# EAGLE board EuroCard Backplane (EAGLE 6.5.0)
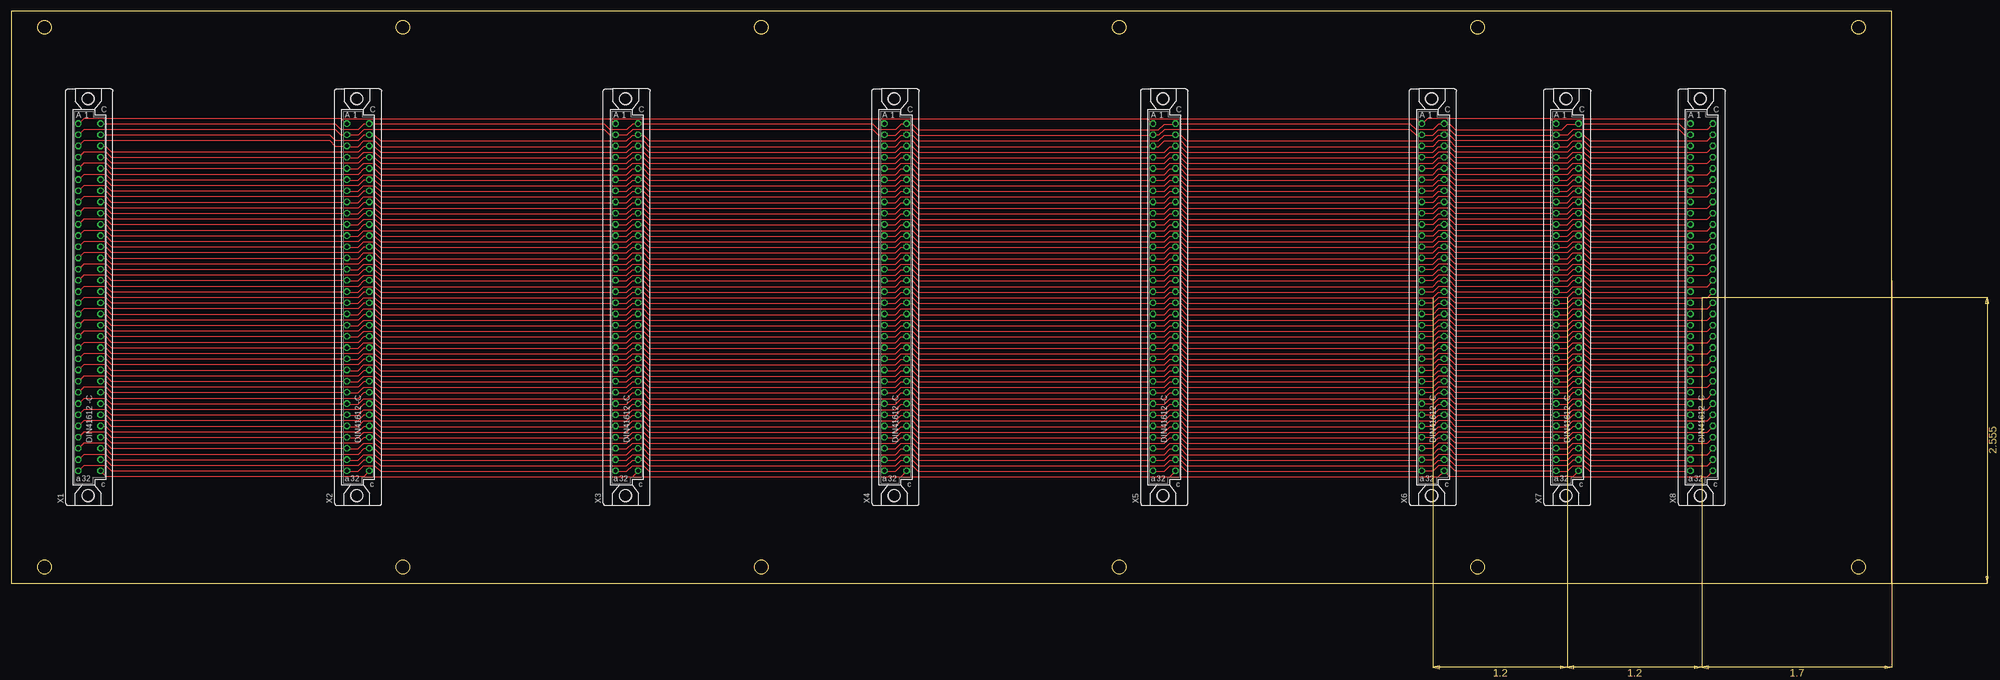
[diagram p1: board, top side]

Size 426.72 x 129.79 mm. Coordinates in mm from the lower left corner, seen from the top.
Copper layers (1+2*15+16): Top 0.035mm / dielectric 1.5mm / Route2 0.035mm / dielectric 0.15mm / Route15 0.035mm / dielectric 0.2mm / Bottom 0.035mm
Design rules "default *": minimum track width 10mil, minimum drill 24mil, track to track 8mil, track to pad 8mil, pad to pad 8mil, via to via 8mil, smd to smd 8mil, copper to edge 40mil, drill to drill 8mil, minimum pad ring 10mil, minimum via ring 8mil, stop-mask expansion 4mil, vias tented up to drill 0mil, thermal gap 10mil

## Footprints (pad centres in the part's own frame; a part is rotated, then mirrored left to right if it is on the bottom)
FAC64S = drill 0.914 octagon: A1 -2.54,39.37; A2 -2.54,36.83; A3 -2.54,34.29; A4 -2.54,31.75; A5 -2.54,29.21; A6 -2.54,26.67; A7 -2.54,24.13; A8 -2.54,21.59; A9 -2.54,19.05; A10 -2.54,16.51; A11 -2.54,13.97; A12 -2.54,11.43; A13 -2.54,8.89; A14 -2.54,6.35; A15 -2.54,3.81; A16 -2.54,1.27; A17 -2.54,-1.27; A18 -2.54,-3.81; A19 -2.54,-6.35; A20 -2.54,-8.89; A21 -2.54,-11.43; A22 -2.54,-13.97; A23 -2.54,-16.51; A24 -2.54,-19.05; A25 -2.54,-21.59; A26 -2.54,-24.13; A27 -2.54,-26.67; A28 -2.54,-29.21; A29 -2.54,-31.75; A30 -2.54,-34.29; A31 -2.54,-36.83; A32 -2.54,-39.37; C1 2.54,39.37; C2 2.54,36.83; C3 2.54,34.29; C4 2.54,31.75; C5 2.54,29.21; C6 2.54,26.67; C7 2.54,24.13; C8 2.54,21.59; C9 2.54,19.05; C10 2.54,16.51; C11 2.54,13.97; C12 2.54,11.43; C13 2.54,8.89; C14 2.54,6.35; C15 2.54,3.81; C16 2.54,1.27; C17 2.54,-1.27; C18 2.54,-3.81; C19 2.54,-6.35; C20 2.54,-8.89; C21 2.54,-11.43; C22 2.54,-13.97; C23 2.54,-16.51; C24 2.54,-19.05; C25 2.54,-21.59; C26 2.54,-24.13; C27 2.54,-26.67; C28 2.54,-29.21; C29 2.54,-31.75; C30 2.54,-34.29; C31 2.54,-36.83; C32 2.54,-39.37 | hole 2.794: -0.305,45.009; -0.305,-45.009

## Placement (x,y rotation side)
U$1  BACKPLANE  [BACKPLANE]  0,0 0 top
X1  FAC64S  [FAC64S]  17.78,64.9 0 top
X2  FAC64S  [FAC64S]  78.74,64.9 0 top
X3  FAC64S  [FAC64S]  139.7,64.9 0 top
X4  FAC64S  [FAC64S]  200.66,64.9 0 top
X5  FAC64S  [FAC64S]  261.62,64.9 0 top
X6  FAC64S  [FAC64S]  322.58,64.9 0 top
X7  FAC64S  [FAC64S]  353.06,64.9 0 top
X8  FAC64S  [FAC64S]  383.54,64.9 0 top

## Tracks (layer width: path | path; a pad name or v marks a point on that pad's centre or on a via)
A1
  Top 0.254: 320.04,104.14 321.31,105.41 349.25,105.41 | 349.25,105.41 350.52,104.14 X7.A1 | 349.25,105.41 379.73,105.41 381,104.14 X8.A1 | 74.93,105.41 16.51,105.41 15.24,104.14 X1.A1 | 74.93,105.41 76.2,104.14 X2.A1 | 135.89,105.41 137.16,104.14 X3.A1 | 74.93,105.41 135.89,105.41 | 196.85,105.41 198.12,104.14 X4.A1 | 135.89,105.41 196.85,105.41 | 257.81,105.41 259.08,104.14 X5.A1 | 196.85,105.41 257.81,105.41 | 320.04,104.14 318.77,105.41 257.81,105.41 | 320.04,104.14 X6.A1
A2
  Top 0.254: 350.52,101.6 353.06,101.6 354.33,102.87 378.46,102.87 379.73,101.6 381,101.6 X8.A2 | 259.08,101.6 260.35,101.6 261.62,102.87 317.5,102.87 318.77,101.6 320.04,101.6 | 350.52,101.6 327.66,101.6 326.39,102.87 323.85,102.87 322.58,101.6 320.04,101.6 | 350.52,101.6 X7.A2 | 320.04,101.6 X6.A2 | 76.2,101.6 74.93,101.6 73.66,102.87 16.51,102.87 15.24,101.6 X1.A2 | 137.16,101.6 139.7,101.6 140.97,102.87 195.58,102.87 196.85,101.6 198.12,101.6 | 76.2,101.6 78.74,101.6 80.01,102.87 134.62,102.87 135.89,101.6 137.16,101.6 | 76.2,101.6 X2.A2 | 137.16,101.6 X3.A2 | 259.08,101.6 205.74,101.6 204.47,102.87 201.93,102.87 200.66,101.6 198.12,101.6 | 259.08,101.6 X5.A2 | 198.12,101.6 X4.A2
A3
  Top 0.254: 320.04,99.06 322.58,99.06 323.85,100.33 326.39,100.33 327.66,99.06 350.52,99.06 | 350.52,99.06 353.06,99.06 354.33,100.33 356.87,100.33 358.14,99.06 381,99.06 X8.A3 | 350.52,99.06 X7.A3 | 76.2,99.06 73.66,99.06 72.39,100.33 16.51,100.33 15.24,99.06 X1.A3 | 137.16,99.06 83.82,99.06 82.55,100.33 80.01,100.33 78.74,99.06 76.2,99.06 | 76.2,99.06 X2.A3 | 198.12,99.06 144.78,99.06 143.51,100.33 140.97,100.33 139.7,99.06 137.16,99.06 | 137.16,99.06 X3.A3 | 259.08,99.06 205.74,99.06 204.47,100.33 201.93,100.33 200.66,99.06 198.12,99.06 | 198.12,99.06 X4.A3 | 320.04,99.06 266.7,99.06 265.43,100.33 261.62,100.33 260.35,99.06 259.08,99.06 | 320.04,99.06 X6.A3 | 259.08,99.06 X5.A3
A4
  Top 0.254: 320.04,96.52 322.58,96.52 323.85,97.79 326.39,97.79 327.66,96.52 350.52,96.52 | 350.52,96.52 353.06,96.52 354.33,97.79 356.87,97.79 358.14,96.52 381,96.52 X8.A4 | 350.52,96.52 X7.A4 | 76.2,96.52 22.86,96.52 21.59,97.79 16.51,97.79 15.24,96.52 X1.A4 | 137.16,96.52 83.82,96.52 82.55,97.79 80.01,97.79 78.74,96.52 76.2,96.52 | 76.2,96.52 X2.A4 | 198.12,96.52 144.78,96.52 143.51,97.79 140.97,97.79 139.7,96.52 137.16,96.52 | 137.16,96.52 X3.A4 | 259.08,96.52 205.74,96.52 204.47,97.79 201.93,97.79 200.66,96.52 198.12,96.52 | 198.12,96.52 X4.A4 | 320.04,96.52 266.7,96.52 265.43,97.79 262.89,97.79 261.62,96.52 259.08,96.52 | 320.04,96.52 X6.A4 | 259.08,96.52 X5.A4
A5
  Top 0.254: 320.04,93.98 322.58,93.98 323.85,95.25 326.39,95.25 327.66,93.98 350.52,93.98 | 350.52,93.98 353.06,93.98 354.33,95.25 356.87,95.25 358.14,93.98 381,93.98 X8.A5 | 350.52,93.98 X7.A5 | 76.2,93.98 22.86,93.98 21.59,95.25 16.51,95.25 15.24,93.98 X1.A5 | 137.16,93.98 83.82,93.98 82.55,95.25 80.01,95.25 78.74,93.98 76.2,93.98 | 76.2,93.98 X2.A5 | 198.12,93.98 144.78,93.98 143.51,95.25 140.97,95.25 139.7,93.98 137.16,93.98 | 137.16,93.98 X3.A5 | 259.08,93.98 205.74,93.98 204.47,95.25 201.93,95.25 200.66,93.98 198.12,93.98 | 198.12,93.98 X4.A5 | 320.04,93.98 266.7,93.98 265.43,95.25 262.89,95.25 261.62,93.98 259.08,93.98 | 320.04,93.98 X6.A5 | 259.08,93.98 X5.A5
A6
  Top 0.254: 320.04,91.44 322.58,91.44 323.85,92.71 326.39,92.71 327.66,91.44 350.52,91.44 | 350.52,91.44 353.06,91.44 354.33,92.71 356.87,92.71 358.14,91.44 381,91.44 X8.A6 | 350.52,91.44 X7.A6 | 76.2,91.44 22.86,91.44 21.59,92.71 16.51,92.71 15.24,91.44 X1.A6 | 137.16,91.44 83.82,91.44 82.55,92.71 80.01,92.71 78.74,91.44 76.2,91.44 | 76.2,91.44 X2.A6 | 198.12,91.44 144.78,91.44 143.51,92.71 140.97,92.71 139.7,91.44 137.16,91.44 | 137.16,91.44 X3.A6 | 259.08,91.44 205.74,91.44 204.47,92.71 201.93,92.71 200.66,91.44 198.12,91.44 | 198.12,91.44 X4.A6 | 320.04,91.44 266.7,91.44 265.43,92.71 262.89,92.71 261.62,91.44 259.08,91.44 | 320.04,91.44 X6.A6 | 259.08,91.44 X5.A6
A7
  Top 0.254: 320.04,88.9 322.58,88.9 323.85,90.17 326.39,90.17 327.66,88.9 350.52,88.9 | 350.52,88.9 353.06,88.9 354.33,90.17 356.87,90.17 358.14,88.9 381,88.9 X8.A7 | 350.52,88.9 X7.A7 | 76.2,88.9 22.86,88.9 21.59,90.17 16.51,90.17 15.24,88.9 X1.A7 | 137.16,88.9 83.82,88.9 82.55,90.17 80.01,90.17 78.74,88.9 76.2,88.9 | 76.2,88.9 X2.A7 | 198.12,88.9 144.78,88.9 143.51,90.17 140.97,90.17 139.7,88.9 137.16,88.9 | 137.16,88.9 X3.A7 | 259.08,88.9 205.74,88.9 204.47,90.17 201.93,90.17 200.66,88.9 198.12,88.9 | 198.12,88.9 X4.A7 | 320.04,88.9 266.7,88.9 265.43,90.17 262.89,90.17 261.62,88.9 259.08,88.9 | 320.04,88.9 X6.A7 | 259.08,88.9 X5.A7
A8
  Top 0.254: 320.04,86.36 322.58,86.36 323.85,87.63 326.39,87.63 327.66,86.36 350.52,86.36 | 350.52,86.36 353.06,86.36 354.33,87.63 356.87,87.63 358.14,86.36 381,86.36 X8.A8 | 350.52,86.36 X7.A8 | 76.2,86.36 22.86,86.36 21.59,87.63 16.51,87.63 15.24,86.36 X1.A8 | 137.16,86.36 83.82,86.36 82.55,87.63 80.01,87.63 78.74,86.36 76.2,86.36 | 76.2,86.36 X2.A8 | 198.12,86.36 144.78,86.36 143.51,87.63 140.97,87.63 139.7,86.36 137.16,86.36 | 137.16,86.36 X3.A8 | 259.08,86.36 205.74,86.36 204.47,87.63 201.93,87.63 200.66,86.36 198.12,86.36 | 198.12,86.36 X4.A8 | 320.04,86.36 266.7,86.36 265.43,87.63 262.89,87.63 261.62,86.36 259.08,86.36 | 320.04,86.36 X6.A8 | 259.08,86.36 X5.A8
A9
  Top 0.254: 320.04,83.82 322.58,83.82 323.85,85.09 326.39,85.09 327.66,83.82 350.52,83.82 | 350.52,83.82 353.06,83.82 354.33,85.09 356.87,85.09 358.14,83.82 381,83.82 X8.A9 | 350.52,83.82 X7.A9 | 76.2,83.82 22.86,83.82 21.59,85.09 16.51,85.09 15.24,83.82 X1.A9 | 137.16,83.82 83.82,83.82 82.55,85.09 80.01,85.09 78.74,83.82 76.2,83.82 | 76.2,83.82 X2.A9 | 198.12,83.82 144.78,83.82 143.51,85.09 140.97,85.09 139.7,83.82 137.16,83.82 | 137.16,83.82 X3.A9 | 259.08,83.82 205.74,83.82 204.47,85.09 201.93,85.09 200.66,83.82 198.12,83.82 | 198.12,83.82 X4.A9 | 320.04,83.82 266.7,83.82 265.43,85.09 262.89,85.09 261.62,83.82 259.08,83.82 | 320.04,83.82 X6.A9 | 259.08,83.82 X5.A9
A10
  Top 0.254: 320.04,81.28 322.58,81.28 323.85,82.55 326.39,82.55 327.66,81.28 350.52,81.28 | 350.52,81.28 353.06,81.28 354.33,82.55 356.87,82.55 358.14,81.28 381,81.28 X8.A10 | 350.52,81.28 X7.A10 | 76.2,81.28 22.86,81.28 21.59,82.55 16.51,82.55 15.24,81.28 X1.A10 | 137.16,81.28 83.82,81.28 82.55,82.55 80.01,82.55 78.74,81.28 76.2,81.28 | 76.2,81.28 X2.A10 | 198.12,81.28 144.78,81.28 143.51,82.55 140.97,82.55 139.7,81.28 137.16,81.28 | 137.16,81.28 X3.A10 | 259.08,81.28 205.74,81.28 204.47,82.55 201.93,82.55 200.66,81.28 198.12,81.28 | 198.12,81.28 X4.A10 | 320.04,81.28 266.7,81.28 265.43,82.55 262.89,82.55 261.62,81.28 259.08,81.28 | 320.04,81.28 X6.A10 | 259.08,81.28 X5.A10
A11
  Top 0.254: 320.04,78.74 322.58,78.74 323.85,80.01 326.39,80.01 327.66,78.74 350.52,78.74 | 350.52,78.74 353.06,78.74 354.33,80.01 356.87,80.01 358.14,78.74 381,78.74 X8.A11 | 350.52,78.74 X7.A11 | 76.2,78.74 22.86,78.74 21.59,80.01 16.51,80.01 15.24,78.74 X1.A11 | 137.16,78.74 83.82,78.74 82.55,80.01 80.01,80.01 78.74,78.74 76.2,78.74 | 76.2,78.74 X2.A11 | 198.12,78.74 144.78,78.74 143.51,80.01 140.97,80.01 139.7,78.74 137.16,78.74 | 137.16,78.74 X3.A11 | 259.08,78.74 205.74,78.74 204.47,80.01 201.93,80.01 200.66,78.74 198.12,78.74 | 198.12,78.74 X4.A11 | 320.04,78.74 266.7,78.74 265.43,80.01 262.89,80.01 261.62,78.74 259.08,78.74 | 320.04,78.74 X6.A11 | 259.08,78.74 X5.A11
A12
  Top 0.254: 320.04,76.2 322.58,76.2 323.85,77.47 326.39,77.47 327.66,76.2 350.52,76.2 | 350.52,76.2 353.06,76.2 354.33,77.47 356.87,77.47 358.14,76.2 381,76.2 X8.A12 | 350.52,76.2 X7.A12 | 76.2,76.2 22.86,76.2 21.59,77.47 16.51,77.47 15.24,76.2 X1.A12 | 137.16,76.2 83.82,76.2 82.55,77.47 80.01,77.47 78.74,76.2 76.2,76.2 | 76.2,76.2 X2.A12 | 198.12,76.2 144.78,76.2 143.51,77.47 140.97,77.47 139.7,76.2 137.16,76.2 | 137.16,76.2 X3.A12 | 259.08,76.2 205.74,76.2 204.47,77.47 201.93,77.47 200.66,76.2 198.12,76.2 | 198.12,76.2 X4.A12 | 320.04,76.2 266.7,76.2 265.43,77.47 262.89,77.47 261.62,76.2 259.08,76.2 | 320.04,76.2 X6.A12 | 259.08,76.2 X5.A12
A13
  Top 0.254: 320.04,73.66 322.58,73.66 323.85,74.93 326.39,74.93 327.66,73.66 350.52,73.66 | 350.52,73.66 353.06,73.66 354.33,74.93 356.87,74.93 358.14,73.66 381,73.66 X8.A13 | 350.52,73.66 X7.A13 | 76.2,73.66 22.86,73.66 21.59,74.93 16.51,74.93 15.24,73.66 X1.A13 | 137.16,73.66 83.82,73.66 82.55,74.93 80.01,74.93 78.74,73.66 76.2,73.66 | 76.2,73.66 X2.A13 | 198.12,73.66 144.78,73.66 143.51,74.93 140.97,74.93 139.7,73.66 137.16,73.66 | 137.16,73.66 X3.A13 | 259.08,73.66 205.74,73.66 204.47,74.93 201.93,74.93 200.66,73.66 198.12,73.66 | 198.12,73.66 X4.A13 | 320.04,73.66 266.7,73.66 265.43,74.93 262.89,74.93 261.62,73.66 259.08,73.66 | 320.04,73.66 X6.A13 | 259.08,73.66 X5.A13
A14
  Top 0.254: 320.04,71.12 322.58,71.12 323.85,72.39 326.39,72.39 327.66,71.12 350.52,71.12 | 350.52,71.12 353.06,71.12 354.33,72.39 356.87,72.39 358.14,71.12 381,71.12 X8.A14 | 350.52,71.12 X7.A14 | 76.2,71.12 22.86,71.12 21.59,72.39 16.51,72.39 15.24,71.12 X1.A14 | 137.16,71.12 83.82,71.12 82.55,72.39 80.01,72.39 78.74,71.12 76.2,71.12 | 76.2,71.12 X2.A14 | 198.12,71.12 144.78,71.12 143.51,72.39 140.97,72.39 139.7,71.12 137.16,71.12 | 137.16,71.12 X3.A14 | 259.08,71.12 205.74,71.12 204.47,72.39 201.93,72.39 200.66,71.12 198.12,71.12 | 198.12,71.12 X4.A14 | 320.04,71.12 266.7,71.12 265.43,72.39 262.89,72.39 261.62,71.12 259.08,71.12 | 320.04,71.12 X6.A14 | 259.08,71.12 X5.A14
A15
  Top 0.254: 320.04,68.58 322.58,68.58 323.85,69.85 326.39,69.85 327.66,68.58 350.52,68.58 | 350.52,68.58 353.06,68.58 354.33,69.85 356.87,69.85 358.14,68.58 381,68.58 X8.A15 | 350.52,68.58 X7.A15 | 76.2,68.58 22.86,68.58 21.59,69.85 16.51,69.85 15.24,68.58 X1.A15 | 137.16,68.58 83.82,68.58 82.55,69.85 80.01,69.85 78.74,68.58 76.2,68.58 | 76.2,68.58 X2.A15 | 198.12,68.58 144.78,68.58 143.51,69.85 140.97,69.85 139.7,68.58 137.16,68.58 | 137.16,68.58 X3.A15 | 259.08,68.58 205.74,68.58 204.47,69.85 201.93,69.85 200.66,68.58 198.12,68.58 | 198.12,68.58 X4.A15 | 320.04,68.58 266.7,68.58 265.43,69.85 262.89,69.85 261.62,68.58 259.08,68.58 | 320.04,68.58 X6.A15 | 259.08,68.58 X5.A15
A16
  Top 0.254: 320.04,66.04 322.58,66.04 323.85,67.31 326.39,67.31 327.66,66.04 350.52,66.04 | 350.52,66.04 353.06,66.04 354.33,67.31 356.87,67.31 358.14,66.04 381,66.04 X8.A16 | 350.52,66.04 X7.A16 | 76.2,66.04 22.86,66.04 21.59,67.31 16.51,67.31 15.24,66.04 X1.A16 | 137.16,66.04 83.82,66.04 82.55,67.31 80.01,67.31 78.74,66.04 76.2,66.04 | 76.2,66.04 X2.A16 | 198.12,66.04 144.78,66.04 143.51,67.31 140.97,67.31 139.7,66.04 137.16,66.04 | 137.16,66.04 X3.A16 | 259.08,66.04 205.74,66.04 204.47,67.31 201.93,67.31 200.66,66.04 198.12,66.04 | 198.12,66.04 X4.A16 | 320.04,66.04 266.7,66.04 265.43,67.31 262.89,67.31 261.62,66.04 259.08,66.04 | 320.04,66.04 X6.A16 | 259.08,66.04 X5.A16
A17
  Top 0.254: 320.04,63.5 322.58,63.5 323.85,64.77 326.39,64.77 327.66,63.5 350.52,63.5 | 350.52,63.5 353.06,63.5 354.33,64.77 356.87,64.77 358.14,63.5 381,63.5 X8.A17 | 350.52,63.5 X7.A17 | 76.2,63.5 22.86,63.5 21.59,64.77 16.51,64.77 15.24,63.5 X1.A17 | 137.16,63.5 83.82,63.5 82.55,64.77 80.01,64.77 78.74,63.5 76.2,63.5 | 76.2,63.5 X2.A17 | 198.12,63.5 144.78,63.5 143.51,64.77 140.97,64.77 139.7,63.5 137.16,63.5 | 137.16,63.5 X3.A17 | 259.08,63.5 205.74,63.5 204.47,64.77 201.93,64.77 200.66,63.5 198.12,63.5 | 198.12,63.5 X4.A17 | 320.04,63.5 266.7,63.5 265.43,64.77 262.89,64.77 261.62,63.5 259.08,63.5 | 320.04,63.5 X6.A17 | 259.08,63.5 X5.A17
A18
  Top 0.254: 320.04,60.96 322.58,60.96 323.85,62.23 326.39,62.23 327.66,60.96 350.52,60.96 | 350.52,60.96 353.06,60.96 354.33,62.23 356.87,62.23 358.14,60.96 381,60.96 X8.A18 | 350.52,60.96 X7.A18 | 76.2,60.96 22.86,60.96 21.59,62.23 16.51,62.23 15.24,60.96 X1.A18 | 137.16,60.96 83.82,60.96 82.55,62.23 80.01,62.23 78.74,60.96 76.2,60.96 | 76.2,60.96 X2.A18 | 198.12,60.96 144.78,60.96 143.51,62.23 140.97,62.23 139.7,60.96 137.16,60.96 | 137.16,60.96 X3.A18 | 259.08,60.96 205.74,60.96 204.47,62.23 201.93,62.23 200.66,60.96 198.12,60.96 | 198.12,60.96 X4.A18 | 320.04,60.96 266.7,60.96 265.43,62.23 262.89,62.23 261.62,60.96 259.08,60.96 | 320.04,60.96 X6.A18 | 259.08,60.96 X5.A18
A19
  Top 0.254: 320.04,58.42 322.58,58.42 323.85,59.69 326.39,59.69 327.66,58.42 350.52,58.42 | 350.52,58.42 353.06,58.42 354.33,59.69 356.87,59.69 358.14,58.42 381,58.42 X8.A19 | 350.52,58.42 X7.A19 | 76.2,58.42 22.86,58.42 21.59,59.69 16.51,59.69 15.24,58.42 X1.A19 | 137.16,58.42 83.82,58.42 82.55,59.69 80.01,59.69 78.74,58.42 76.2,58.42 | 76.2,58.42 X2.A19 | 198.12,58.42 144.78,58.42 143.51,59.69 140.97,59.69 139.7,58.42 137.16,58.42 | 137.16,58.42 X3.A19 | 259.08,58.42 205.74,58.42 204.47,59.69 201.93,59.69 200.66,58.42 198.12,58.42 | 198.12,58.42 X4.A19 | 320.04,58.42 266.7,58.42 265.43,59.69 262.89,59.69 261.62,58.42 259.08,58.42 | 320.04,58.42 X6.A19 | 259.08,58.42 X5.A19
A20
  Top 0.254: 320.04,55.88 322.58,55.88 323.85,57.15 326.39,57.15 327.66,55.88 350.52,55.88 | 350.52,55.88 353.06,55.88 354.33,57.15 356.87,57.15 358.14,55.88 381,55.88 X8.A20 | 350.52,55.88 X7.A20 | 76.2,55.88 22.86,55.88 21.59,57.15 16.51,57.15 15.24,55.88 X1.A20 | 137.16,55.88 83.82,55.88 82.55,57.15 80.01,57.15 78.74,55.88 76.2,55.88 | 76.2,55.88 X2.A20 | 198.12,55.88 144.78,55.88 143.51,57.15 140.97,57.15 139.7,55.88 137.16,55.88 | 137.16,55.88 X3.A20 | 259.08,55.88 205.74,55.88 204.47,57.15 201.93,57.15 200.66,55.88 198.12,55.88 | 198.12,55.88 X4.A20 | 320.04,55.88 266.7,55.88 265.43,57.15 262.89,57.15 261.62,55.88 259.08,55.88 | 320.04,55.88 X6.A20 | 259.08,55.88 X5.A20
A21
  Top 0.254: 320.04,53.34 322.58,53.34 323.85,54.61 326.39,54.61 327.66,53.34 350.52,53.34 | 350.52,53.34 353.06,53.34 354.33,54.61 356.87,54.61 358.14,53.34 381,53.34 X8.A21 | 350.52,53.34 X7.A21 | 76.2,53.34 22.86,53.34 21.59,54.61 16.51,54.61 15.24,53.34 X1.A21 | 137.16,53.34 83.82,53.34 82.55,54.61 80.01,54.61 78.74,53.34 76.2,53.34 | 76.2,53.34 X2.A21 | 198.12,53.34 144.78,53.34 143.51,54.61 140.97,54.61 139.7,53.34 137.16,53.34 | 137.16,53.34 X3.A21 | 259.08,53.34 205.74,53.34 204.47,54.61 201.93,54.61 200.66,53.34 198.12,53.34 | 198.12,53.34 X4.A21 | 320.04,53.34 266.7,53.34 265.43,54.61 262.89,54.61 261.62,53.34 259.08,53.34 | 320.04,53.34 X6.A21 | 259.08,53.34 X5.A21
A22
  Top 0.254: 320.04,50.8 322.58,50.8 323.85,52.07 326.39,52.07 327.66,50.8 350.52,50.8 | 350.52,50.8 353.06,50.8 354.33,52.07 356.87,52.07 358.14,50.8 381,50.8 X8.A22 | 350.52,50.8 X7.A22 | 76.2,50.8 22.86,50.8 21.59,52.07 16.51,52.07 15.24,50.8 X1.A22 | 137.16,50.8 83.82,50.8 82.55,52.07 80.01,52.07 78.74,50.8 76.2,50.8 | 76.2,50.8 X2.A22 | 198.12,50.8 144.78,50.8 143.51,52.07 140.97,52.07 139.7,50.8 137.16,50.8 | 137.16,50.8 X3.A22 | 259.08,50.8 205.74,50.8 204.47,52.07 201.93,52.07 200.66,50.8 198.12,50.8 | 198.12,50.8 X4.A22 | 320.04,50.8 266.7,50.8 265.43,52.07 262.89,52.07 261.62,50.8 259.08,50.8 | 320.04,50.8 X6.A22 | 259.08,50.8 X5.A22
A23
  Top 0.254: 320.04,48.26 322.58,48.26 323.85,49.53 326.39,49.53 327.66,48.26 350.52,48.26 | 350.52,48.26 353.06,48.26 354.33,49.53 356.87,49.53 358.14,48.26 381,48.26 X8.A23 | 350.52,48.26 X7.A23 | 76.2,48.26 22.86,48.26 21.59,49.53 16.51,49.53 15.24,48.26 X1.A23 | 137.16,48.26 83.82,48.26 82.55,49.53 80.01,49.53 78.74,48.26 76.2,48.26 | 76.2,48.26 X2.A23 | 198.12,48.26 144.78,48.26 143.51,49.53 140.97,49.53 139.7,48.26 137.16,48.26 | 137.16,48.26 X3.A23 | 259.08,48.26 205.74,48.26 204.47,49.53 201.93,49.53 200.66,48.26 198.12,48.26 | 198.12,48.26 X4.A23 | 320.04,48.26 266.7,48.26 265.43,49.53 262.89,49.53 261.62,48.26 259.08,48.26 | 320.04,48.26 X6.A23 | 259.08,48.26 X5.A23
A24
  Top 0.254: 320.04,45.72 322.58,45.72 323.85,46.99 326.39,46.99 327.66,45.72 350.52,45.72 | 350.52,45.72 353.06,45.72 354.33,46.99 356.87,46.99 358.14,45.72 381,45.72 X8.A24 | 350.52,45.72 X7.A24 | 76.2,45.72 22.86,45.72 21.59,46.99 16.51,46.99 15.24,45.72 X1.A24 | 137.16,45.72 83.82,45.72 82.55,46.99 80.01,46.99 78.74,45.72 76.2,45.72 | 76.2,45.72 X2.A24 | 198.12,45.72 144.78,45.72 143.51,46.99 140.97,46.99 139.7,45.72 137.16,45.72 | 137.16,45.72 X3.A24 | 259.08,45.72 205.74,45.72 204.47,46.99 201.93,46.99 200.66,45.72 198.12,45.72 | 198.12,45.72 X4.A24 | 320.04,45.72 266.7,45.72 265.43,46.99 262.89,46.99 261.62,45.72 259.08,45.72 | 320.04,45.72 X6.A24 | 259.08,45.72 X5.A24
A25
  Top 0.254: 320.04,43.18 322.58,43.18 323.85,44.45 326.39,44.45 327.66,43.18 350.52,43.18 | 350.52,43.18 353.06,43.18 354.33,44.45 356.87,44.45 358.14,43.18 381,43.18 X8.A25 | 350.52,43.18 X7.A25 | 76.2,43.18 22.86,43.18 21.59,44.45 16.51,44.45 15.24,43.18 X1.A25 | 137.16,43.18 83.82,43.18 82.55,44.45 80.01,44.45 78.74,43.18 76.2,43.18 | 76.2,43.18 X2.A25 | 198.12,43.18 144.78,43.18 143.51,44.45 140.97,44.45 139.7,43.18 137.16,43.18 | 137.16,43.18 X3.A25 | 259.08,43.18 205.74,43.18 204.47,44.45 201.93,44.45 200.66,43.18 198.12,43.18 | 198.12,43.18 X4.A25 | 320.04,43.18 266.7,43.18 265.43,44.45 262.89,44.45 261.62,43.18 259.08,43.18 | 320.04,43.18 X6.A25 | 259.08,43.18 X5.A25
A26
  Top 0.254: 320.04,40.64 322.58,40.64 323.85,41.91 326.39,41.91 327.66,40.64 350.52,40.64 | 350.52,40.64 353.06,40.64 354.33,41.91 356.87,41.91 358.14,40.64 381,40.64 X8.A26 | 350.52,40.64 X7.A26 | 76.2,40.64 22.86,40.64 21.59,41.91 16.51,41.91 15.24,40.64 X1.A26 | 137.16,40.64 83.82,40.64 82.55,41.91 80.01,41.91 78.74,40.64 76.2,40.64 | 76.2,40.64 X2.A26 | 198.12,40.64 144.78,40.64 143.51,41.91 140.97,41.91 139.7,40.64 137.16,40.64 | 137.16,40.64 X3.A26 | 259.08,40.64 205.74,40.64 204.47,41.91 201.93,41.91 200.66,40.64 198.12,40.64 | 198.12,40.64 X4.A26 | 320.04,40.64 266.7,40.64 265.43,41.91 262.89,41.91 261.62,40.64 259.08,40.64 | 320.04,40.64 X6.A26 | 259.08,40.64 X5.A26
A27
  Top 0.254: 320.04,38.1 322.58,38.1 323.85,39.37 326.39,39.37 327.66,38.1 350.52,38.1 | 350.52,38.1 353.06,38.1 354.33,39.37 356.87,39.37 358.14,38.1 381,38.1 X8.A27 | 350.52,38.1 X7.A27 | 76.2,38.1 22.86,38.1 21.59,39.37 16.51,39.37 15.24,38.1 X1.A27 | 137.16,38.1 83.82,38.1 82.55,39.37 80.01,39.37 78.74,38.1 76.2,38.1 | 76.2,38.1 X2.A27 | 198.12,38.1 144.78,38.1 143.51,39.37 140.97,39.37 139.7,38.1 137.16,38.1 | 137.16,38.1 X3.A27 | 259.08,38.1 205.74,38.1 204.47,39.37 201.93,39.37 200.66,38.1 198.12,38.1 | 198.12,38.1 X4.A27 | 320.04,38.1 266.7,38.1 265.43,39.37 262.89,39.37 261.62,38.1 259.08,38.1 | 320.04,38.1 X6.A27 | 259.08,38.1 X5.A27
A28
  Top 0.254: 320.04,35.56 322.58,35.56 323.85,36.83 326.39,36.83 327.66,35.56 350.52,35.56 | 350.52,35.56 353.06,35.56 354.33,36.83 356.87,36.83 358.14,35.56 381,35.56 X8.A28 | 350.52,35.56 X7.A28 | 76.2,35.56 22.86,35.56 21.59,36.83 16.51,36.83 15.24,35.56 X1.A28 | 137.16,35.56 83.82,35.56 82.55,36.83 80.01,36.83 78.74,35.56 76.2,35.56 | 76.2,35.56 X2.A28 | 198.12,35.56 144.78,35.56 143.51,36.83 140.97,36.83 139.7,35.56 137.16,35.56 | 137.16,35.56 X3.A28 | 259.08,35.56 205.74,35.56 204.47,36.83 201.93,36.83 200.66,35.56 198.12,35.56 | 198.12,35.56 X4.A28 | 320.04,35.56 266.7,35.56 265.43,36.83 262.89,36.83 261.62,35.56 259.08,35.56 | 320.04,35.56 X6.A28 | 259.08,35.56 X5.A28
A29
  Top 0.254: 320.04,33.02 322.58,33.02 323.85,34.29 326.39,34.29 327.66,33.02 350.52,33.02 | 350.52,33.02 353.06,33.02 354.33,34.29 356.87,34.29 358.14,33.02 381,33.02 X8.A29 | 350.52,33.02 X7.A29 | 76.2,33.02 22.86,33.02 21.59,34.29 16.51,34.29 15.24,33.02 X1.A29 | 137.16,33.02 83.82,33.02 82.55,34.29 80.01,34.29 78.74,33.02 76.2,33.02 | 76.2,33.02 X2.A29 | 198.12,33.02 144.78,33.02 143.51,34.29 140.97,34.29 139.7,33.02 137.16,33.02 | 137.16,33.02 X3.A29 | 259.08,33.02 205.74,33.02 204.47,34.29 201.93,34.29 200.66,33.02 198.12,33.02 | 198.12,33.02 X4.A29 | 320.04,33.02 266.7,33.02 265.43,34.29 262.89,34.29 261.62,33.02 259.08,33.02 | 320.04,33.02 X6.A29 | 259.08,33.02 X5.A29
A30
  Top 0.254: 320.04,30.48 322.58,30.48 323.85,31.75 326.39,31.75 327.66,30.48 350.52,30.48 | 350.52,30.48 353.06,30.48 354.33,31.75 356.87,31.75 358.14,30.48 381,30.48 X8.A30 | 350.52,30.48 X7.A30 | 76.2,30.48 22.86,30.48 21.59,31.75 16.51,31.75 15.24,30.48 X1.A30 | 137.16,30.48 83.82,30.48 82.55,31.75 80.01,31.75 78.74,30.48 76.2,30.48 | 76.2,30.48 X2.A30 | 198.12,30.48 144.78,30.48 143.51,31.75 140.97,31.75 139.7,30.48 137.16,30.48 | 137.16,30.48 X3.A30 | 259.08,30.48 205.74,30.48 204.47,31.75 201.93,31.75 200.66,30.48 198.12,30.48 | 198.12,30.48 X4.A30 | 320.04,30.48 266.7,30.48 265.43,31.75 262.89,31.75 261.62,30.48 259.08,30.48 | 320.04,30.48 X6.A30 | 259.08,30.48 X5.A30
A31
  Top 0.254: 320.04,27.94 322.58,27.94 323.85,29.21 326.39,29.21 327.66,27.94 350.52,27.94 | 350.52,27.94 353.06,27.94 354.33,29.21 356.87,29.21 358.14,27.94 381,27.94 X8.A31 | 350.52,27.94 X7.A31 | 76.2,27.94 22.86,27.94 21.59,29.21 16.51,29.21 15.24,27.94 X1.A31 | 137.16,27.94 83.82,27.94 82.55,29.21 80.01,29.21 78.74,27.94 76.2,27.94 | 76.2,27.94 X2.A31 | 198.12,27.94 144.78,27.94 143.51,29.21 140.97,29.21 139.7,27.94 137.16,27.94 | 137.16,27.94 X3.A31 | 259.08,27.94 205.74,27.94 204.47,29.21 201.93,29.21 200.66,27.94 198.12,27.94 | 198.12,27.94 X4.A31 | 320.04,27.94 266.7,27.94 265.43,29.21 262.89,29.21 261.62,27.94 259.08,27.94 | 320.04,27.94 X6.A31 | 259.08,27.94 X5.A31
A32
  Top 0.254: 320.04,25.4 322.58,25.4 323.85,26.67 326.39,26.67 327.66,25.4 350.52,25.4 | 350.52,25.4 353.06,25.4 354.33,26.67 356.87,26.67 358.14,25.4 381,25.4 X8.A32 | 350.52,25.4 X7.A32 | 76.2,25.4 22.86,25.4 21.59,26.67 16.51,26.67 15.24,25.4 X1.A32 | 137.16,25.4 83.82,25.4 82.55,26.67 80.01,26.67 78.74,25.4 76.2,25.4 | 76.2,25.4 X2.A32 | 198.12,25.4 144.78,25.4 143.51,26.67 140.97,26.67 139.7,25.4 137.16,25.4 | 137.16,25.4 X3.A32 | 259.08,25.4 205.74,25.4 204.47,26.67 201.93,26.67 200.66,25.4 198.12,25.4 | 198.12,25.4 X4.A32 | 320.04,25.4 266.7,25.4 265.43,26.67 262.89,26.67 261.62,25.4 259.08,25.4 | 320.04,25.4 X6.A32 | 259.08,25.4 X5.A32
C1
  Top 0.254: 355.6,104.14 378.46,104.14 379.73,102.87 384.81,102.87 386.08,104.14 X8.C1 | 264.16,104.14 317.5,104.14 318.77,102.87 322.58,102.87 323.85,104.14 325.12,104.14 | 355.6,104.14 353.06,104.14 351.79,102.87 327.66,102.87 326.39,104.14 325.12,104.14 | 355.6,104.14 X7.C1 | 325.12,104.14 X6.C1 | 81.28,104.14 80.01,104.14 78.74,102.87 74.93,102.87 73.66,104.14 20.32,104.14 X1.C1 | 142.24,104.14 195.58,104.14 196.85,102.87 200.66,102.87 201.93,104.14 203.2,104.14 | 81.28,104.14 134.62,104.14 135.89,102.87 139.7,102.87 140.97,104.14 142.24,104.14 | 81.28,104.14 X2.C1 | 142.24,104.14 X3.C1 | 264.16,104.14 261.62,104.14 260.35,102.87 205.74,102.87 204.47,104.14 203.2,104.14 | 264.16,104.14 X5.C1 | 203.2,104.14 X4.C1
C2
  Top 0.254: 325.12,101.6 326.39,101.6 327.66,100.33 353.06,100.33 354.33,101.6 355.6,101.6 | 355.6,101.6 356.87,101.6 358.14,100.33 384.81,100.33 386.08,101.6 X8.C2 | 355.6,101.6 X7.C2 | 81.28,101.6 80.01,101.6 78.74,100.33 73.66,100.33 72.39,101.6 20.32,101.6 X1.C2 | 142.24,101.6 140.97,101.6 139.7,100.33 83.82,100.33 82.55,101.6 81.28,101.6 | 81.28,101.6 X2.C2 | 203.2,101.6 201.93,101.6 200.66,100.33 144.78,100.33 143.51,101.6 142.24,101.6 | 142.24,101.6 X3.C2 | 264.16,101.6 261.62,101.6 260.35,100.33 205.74,100.33 204.47,101.6 203.2,101.6 | 203.2,101.6 X4.C2 | 325.12,101.6 323.85,101.6 322.58,100.33 266.7,100.33 265.43,101.6 264.16,101.6 | 325.12,101.6 X6.C2 | 264.16,101.6 X5.C2
C3
  Top 0.254: 325.12,99.06 326.39,99.06 327.66,97.79 353.06,97.79 354.33,99.06 355.6,99.06 | 355.6,99.06 356.87,99.06 358.14,97.79 384.81,97.79 386.08,99.06 X8.C3 | 355.6,99.06 X7.C3 | 81.28,99.06 80.01,99.06 78.74,97.79 22.86,97.79 21.59,99.06 20.32,99.06 X1.C3 | 142.24,99.06 140.97,99.06 139.7,97.79 83.82,97.79 82.55,99.06 81.28,99.06 | 81.28,99.06 X2.C3 | 203.2,99.06 201.93,99.06 200.66,97.79 144.78,97.79 143.51,99.06 142.24,99.06 | 142.24,99.06 X3.C3 | 264.16,99.06 262.89,99.06 261.62,97.79 205.74,97.79 204.47,99.06 203.2,99.06 | 203.2,99.06 X4.C3 | 325.12,99.06 323.85,99.06 322.58,97.79 266.7,97.79 265.43,99.06 264.16,99.06 | 325.12,99.06 X6.C3 | 264.16,99.06 X5.C3
C4
  Top 0.254: 325.12,96.52 326.39,96.52 327.66,95.25 353.06,95.25 354.33,96.52 355.6,96.52 | 355.6,96.52 356.87,96.52 358.14,95.25 384.81,95.25 386.08,96.52 X8.C4 | 355.6,96.52 X7.C4 | 81.28,96.52 80.01,96.52 78.74,95.25 22.86,95.25 21.59,96.52 20.32,96.52 X1.C4 | 142.24,96.52 140.97,96.52 139.7,95.25 83.82,95.25 82.55,96.52 81.28,96.52 | 81.28,96.52 X2.C4 | 203.2,96.52 201.93,96.52 200.66,95.25 144.78,95.25 143.51,96.52 142.24,96.52 | 142.24,96.52 X3.C4 | 264.16,96.52 262.89,96.52 261.62,95.25 205.74,95.25 204.47,96.52 203.2,96.52 | 203.2,96.52 X4.C4 | 325.12,96.52 323.85,96.52 322.58,95.25 266.7,95.25 265.43,96.52 264.16,96.52 | 325.12,96.52 X6.C4 | 264.16,96.52 X5.C4
C5
  Top 0.254: 325.12,93.98 326.39,93.98 327.66,92.71 353.06,92.71 354.33,93.98 355.6,93.98 | 355.6,93.98 356.87,93.98 358.14,92.71 384.81,92.71 386.08,93.98 X8.C5 | 355.6,93.98 X7.C5 | 81.28,93.98 80.01,93.98 78.74,92.71 22.86,92.71 21.59,93.98 20.32,93.98 X1.C5 | 142.24,93.98 140.97,93.98 139.7,92.71 83.82,92.71 82.55,93.98 81.28,93.98 | 81.28,93.98 X2.C5 | 203.2,93.98 201.93,93.98 200.66,92.71 144.78,92.71 143.51,93.98 142.24,93.98 | 142.24,93.98 X3.C5 | 264.16,93.98 262.89,93.98 261.62,92.71 205.74,92.71 204.47,93.98 203.2,93.98 | 203.2,93.98 X4.C5 | 325.12,93.98 323.85,93.98 322.58,92.71 266.7,92.71 265.43,93.98 264.16,93.98 | 325.12,93.98 X6.C5 | 264.16,93.98 X5.C5
C6
  Top 0.254: 325.12,91.44 326.39,91.44 327.66,90.17 353.06,90.17 354.33,91.44 355.6,91.44 | 355.6,91.44 356.87,91.44 358.14,90.17 384.81,90.17 386.08,91.44 X8.C6 | 355.6,91.44 X7.C6 | 81.28,91.44 80.01,91.44 78.74,90.17 22.86,90.17 21.59,91.44 20.32,91.44 X1.C6 | 142.24,91.44 140.97,91.44 139.7,90.17 83.82,90.17 82.55,91.44 81.28,91.44 | 81.28,91.44 X2.C6 | 203.2,91.44 201.93,91.44 200.66,90.17 144.78,90.17 143.51,91.44 142.24,91.44 | 142.24,91.44 X3.C6 | 264.16,91.44 262.89,91.44 261.62,90.17 205.74,90.17 204.47,91.44 203.2,91.44 | 203.2,91.44 X4.C6 | 325.12,91.44 323.85,91.44 322.58,90.17 266.7,90.17 265.43,91.44 264.16,91.44 | 325.12,91.44 X6.C6 | 264.16,91.44 X5.C6
C7
  Top 0.254: 325.12,88.9 326.39,88.9 327.66,87.63 353.06,87.63 354.33,88.9 355.6,88.9 | 355.6,88.9 356.87,88.9 358.14,87.63 384.81,87.63 386.08,88.9 X8.C7 | 355.6,88.9 X7.C7 | 81.28,88.9 80.01,88.9 78.74,87.63 22.86,87.63 21.59,88.9 20.32,88.9 X1.C7 | 142.24,88.9 140.97,88.9 139.7,87.63 83.82,87.63 82.55,88.9 81.28,88.9 | 81.28,88.9 X2.C7 | 203.2,88.9 201.93,88.9 200.66,87.63 144.78,87.63 143.51,88.9 142.24,88.9 | 142.24,88.9 X3.C7 | 264.16,88.9 262.89,88.9 261.62,87.63 205.74,87.63 204.47,88.9 203.2,88.9 | 203.2,88.9 X4.C7 | 325.12,88.9 323.85,88.9 322.58,87.63 266.7,87.63 265.43,88.9 264.16,88.9 | 325.12,88.9 X6.C7 | 264.16,88.9 X5.C7
C8
  Top 0.254: 325.12,86.36 326.39,86.36 327.66,85.09 353.06,85.09 354.33,86.36 355.6,86.36 | 355.6,86.36 356.87,86.36 358.14,85.09 384.81,85.09 386.08,86.36 X8.C8 | 355.6,86.36 X7.C8 | 81.28,86.36 80.01,86.36 78.74,85.09 22.86,85.09 21.59,86.36 20.32,86.36 X1.C8 | 142.24,86.36 140.97,86.36 139.7,85.09 83.82,85.09 82.55,86.36 81.28,86.36 | 81.28,86.36 X2.C8 | 203.2,86.36 201.93,86.36 200.66,85.09 144.78,85.09 143.51,86.36 142.24,86.36 | 142.24,86.36 X3.C8 | 264.16,86.36 262.89,86.36 261.62,85.09 205.74,85.09 204.47,86.36 203.2,86.36 | 203.2,86.36 X4.C8 | 325.12,86.36 323.85,86.36 322.58,85.09 266.7,85.09 265.43,86.36 264.16,86.36 | 325.12,86.36 X6.C8 | 264.16,86.36 X5.C8
C9
  Top 0.254: 325.12,83.82 326.39,83.82 327.66,82.55 353.06,82.55 354.33,83.82 355.6,83.82 | 355.6,83.82 356.87,83.82 358.14,82.55 384.81,82.55 386.08,83.82 X8.C9 | 355.6,83.82 X7.C9 | 81.28,83.82 80.01,83.82 78.74,82.55 22.86,82.55 21.59,83.82 20.32,83.82 X1.C9 | 142.24,83.82 140.97,83.82 139.7,82.55 83.82,82.55 82.55,83.82 81.28,83.82 | 81.28,83.82 X2.C9 | 203.2,83.82 201.93,83.82 200.66,82.55 144.78,82.55 143.51,83.82 142.24,83.82 | 142.24,83.82 X3.C9 | 264.16,83.82 262.89,83.82 261.62,82.55 205.74,82.55 204.47,83.82 203.2,83.82 | 203.2,83.82 X4.C9 | 325.12,83.82 323.85,83.82 322.58,82.55 266.7,82.55 265.43,83.82 264.16,83.82 | 325.12,83.82 X6.C9 | 264.16,83.82 X5.C9
C10
  Top 0.254: 325.12,81.28 326.39,81.28 327.66,80.01 353.06,80.01 354.33,81.28 355.6,81.28 | 355.6,81.28 356.87,81.28 358.14,80.01 384.81,80.01 386.08,81.28 X8.C10 | 355.6,81.28 X7.C10 | 81.28,81.28 80.01,81.28 78.74,80.01 22.86,80.01 21.59,81.28 20.32,81.28 X1.C10 | 142.24,81.28 140.97,81.28 139.7,80.01 83.82,80.01 82.55,81.28 81.28,81.28 | 81.28,81.28 X2.C10 | 203.2,81.28 201.93,81.28 200.66,80.01 144.78,80.01 143.51,81.28 142.24,81.28 | 142.24,81.28 X3.C10 | 264.16,81.28 262.89,81.28 261.62,80.01 205.74,80.01 204.47,81.28 203.2,81.28 | 203.2,81.28 X4.C10 | 325.12,81.28 323.85,81.28 322.58,80.01 266.7,80.01 265.43,81.28 264.16,81.28 | 325.12,81.28 X6.C10 | 264.16,81.28 X5.C10
C11
  Top 0.254: 325.12,78.74 326.39,78.74 327.66,77.47 353.06,77.47 354.33,78.74 355.6,78.74 | 355.6,78.74 356.87,78.74 358.14,77.47 384.81,77.47 386.08,78.74 X8.C11 | 355.6,78.74 X7.C11 | 81.28,78.74 80.01,78.74 78.74,77.47 22.86,77.47 21.59,78.74 20.32,78.74 X1.C11 | 142.24,78.74 140.97,78.74 139.7,77.47 83.82,77.47 82.55,78.74 81.28,78.74 | 81.28,78.74 X2.C11 | 203.2,78.74 201.93,78.74 200.66,77.47 144.78,77.47 143.51,78.74 142.24,78.74 | 142.24,78.74 X3.C11 | 264.16,78.74 262.89,78.74 261.62,77.47 205.74,77.47 204.47,78.74 203.2,78.74 | 203.2,78.74 X4.C11 | 325.12,78.74 323.85,78.74 322.58,77.47 266.7,77.47 265.43,78.74 264.16,78.74 | 325.12,78.74 X6.C11 | 264.16,78.74 X5.C11
C12
  Top 0.254: 325.12,76.2 326.39,76.2 327.66,74.93 353.06,74.93 354.33,76.2 355.6,76.2 | 355.6,76.2 356.87,76.2 358.14,74.93 384.81,74.93 386.08,76.2 X8.C12 | 355.6,76.2 X7.C12 | 81.28,76.2 80.01,76.2 78.74,74.93 22.86,74.93 21.59,76.2 20.32,76.2 X1.C12 | 142.24,76.2 140.97,76.2 139.7,74.93 83.82,74.93 82.55,76.2 81.28,76.2 | 81.28,76.2 X2.C12 | 203.2,76.2 201.93,76.2 200.66,74.93 144.78,74.93 143.51,76.2 142.24,76.2 | 142.24,76.2 X3.C12 | 264.16,76.2 262.89,76.2 261.62,74.93 205.74,74.93 204.47,76.2 203.2,76.2 | 203.2,76.2 X4.C12 | 325.12,76.2 323.85,76.2 322.58,74.93 266.7,74.93 265.43,76.2 264.16,76.2 | 325.12,76.2 X6.C12 | 264.16,76.2 X5.C12
C13
  Top 0.254: 325.12,73.66 326.39,73.66 327.66,72.39 353.06,72.39 354.33,73.66 355.6,73.66 | 355.6,73.66 356.87,73.66 358.14,72.39 384.81,72.39 386.08,73.66 X8.C13 | 355.6,73.66 X7.C13 | 81.28,73.66 80.01,73.66 78.74,72.39 22.86,72.39 21.59,73.66 20.32,73.66 X1.C13 | 142.24,73.66 140.97,73.66 139.7,72.39 83.82,72.39 82.55,73.66 81.28,73.66 | 81.28,73.66 X2.C13 | 203.2,73.66 201.93,73.66 200.66,72.39 144.78,72.39 143.51,73.66 142.24,73.66 | 142.24,73.66 X3.C13 | 264.16,73.66 262.89,73.66 261.62,72.39 205.74,72.39 204.47,73.66 203.2,73.66 | 203.2,73.66 X4.C13 | 325.12,73.66 323.85,73.66 322.58,72.39 266.7,72.39 265.43,73.66 264.16,73.66 | 325.12,73.66 X6.C13 | 264.16,73.66 X5.C13
C14
  Top 0.254: 325.12,71.12 326.39,71.12 327.66,69.85 353.06,69.85 354.33,71.12 355.6,71.12 | 355.6,71.12 356.87,71.12 358.14,69.85 384.81,69.85 386.08,71.12 X8.C14 | 355.6,71.12 X7.C14 | 81.28,71.12 80.01,71.12 78.74,69.85 22.86,69.85 21.59,71.12 20.32,71.12 X1.C14 | 142.24,71.12 140.97,71.12 139.7,69.85 83.82,69.85 82.55,71.12 81.28,71.12 | 81.28,71.12 X2.C14 | 203.2,71.12 201.93,71.12 200.66,69.85 144.78,69.85 143.51,71.12 142.24,71.12 | 142.24,71.12 X3.C14 | 264.16,71.12 262.89,71.12 261.62,69.85 205.74,69.85 204.47,71.12 203.2,71.12 | 203.2,71.12 X4.C14 | 325.12,71.12 323.85,71.12 322.58,69.85 266.7,69.85 265.43,71.12 264.16,71.12 | 325.12,71.12 X6.C14 | 264.16,71.12 X5.C14
C15
  Top 0.254: 325.12,68.58 326.39,68.58 327.66,67.31 353.06,67.31 354.33,68.58 355.6,68.58 | 355.6,68.58 356.87,68.58 358.14,67.31 384.81,67.31 386.08,68.58 X8.C15 | 355.6,68.58 X7.C15 | 81.28,68.58 80.01,68.58 78.74,67.31 22.86,67.31 21.59,68.58 20.32,68.58 X1.C15 | 142.24,68.58 140.97,68.58 139.7,67.31 83.82,67.31 82.55,68.58 81.28,68.58 | 81.28,68.58 X2.C15 | 203.2,68.58 201.93,68.58 200.66,67.31 144.78,67.31 143.51,68.58 142.24,68.58 | 142.24,68.58 X3.C15 | 264.16,68.58 262.89,68.58 261.62,67.31 205.74,67.31 204.47,68.58 203.2,68.58 | 203.2,68.58 X4.C15 | 325.12,68.58 323.85,68.58 322.58,67.31 266.7,67.31 265.43,68.58 264.16,68.58 | 325.12,68.58 X6.C15 | 264.16,68.58 X5.C15
C16
  Top 0.254: 325.12,66.04 326.39,66.04 327.66,64.77 353.06,64.77 354.33,66.04 355.6,66.04 | 355.6,66.04 356.87,66.04 358.14,64.77 384.81,64.77 386.08,66.04 X8.C16 | 355.6,66.04 X7.C16 | 81.28,66.04 80.01,66.04 78.74,64.77 22.86,64.77 21.59,66.04 20.32,66.04 X1.C16 | 142.24,66.04 140.97,66.04 139.7,64.77 83.82,64.77 82.55,66.04 81.28,66.04 | 81.28,66.04 X2.C16 | 203.2,66.04 201.93,66.04 200.66,64.77 144.78,64.77 143.51,66.04 142.24,66.04 | 142.24,66.04 X3.C16 | 264.16,66.04 262.89,66.04 261.62,64.77 205.74,64.77 204.47,66.04 203.2,66.04 | 203.2,66.04 X4.C16 | 325.12,66.04 323.85,66.04 322.58,64.77 266.7,64.77 265.43,66.04 264.16,66.04 | 325.12,66.04 X6.C16 | 264.16,66.04 X5.C16
C17
  Top 0.254: 325.12,63.5 326.39,63.5 327.66,62.23 353.06,62.23 354.33,63.5 355.6,63.5 | 355.6,63.5 356.87,63.5 358.14,62.23 384.81,62.23 386.08,63.5 X8.C17 | 355.6,63.5 X7.C17 | 81.28,63.5 80.01,63.5 78.74,62.23 22.86,62.23 21.59,63.5 20.32,63.5 X1.C17 | 142.24,63.5 140.97,63.5 139.7,62.23 83.82,62.23 82.55,63.5 81.28,63.5 | 81.28,63.5 X2.C17 | 203.2,63.5 201.93,63.5 200.66,62.23 144.78,62.23 143.51,63.5 142.24,63.5 | 142.24,63.5 X3.C17 | 264.16,63.5 262.89,63.5 261.62,62.23 205.74,62.23 204.47,63.5 203.2,63.5 | 203.2,63.5 X4.C17 | 325.12,63.5 323.85,63.5 322.58,62.23 266.7,62.23 265.43,63.5 264.16,63.5 | 325.12,63.5 X6.C17 | 264.16,63.5 X5.C17
C18
  Top 0.254: 325.12,60.96 326.39,60.96 327.66,59.69 353.06,59.69 354.33,60.96 355.6,60.96 | 355.6,60.96 356.87,60.96 358.14,59.69 384.81,59.69 386.08,60.96 X8.C18 | 355.6,60.96 X7.C18 | 81.28,60.96 80.01,60.96 78.74,59.69 22.86,59.69 21.59,60.96 20.32,60.96 X1.C18 | 142.24,60.96 140.97,60.96 139.7,59.69 83.82,59.69 82.55,60.96 81.28,60.96 | 81.28,60.96 X2.C18 | 203.2,60.96 201.93,60.96 200.66,59.69 144.78,59.69 143.51,60.96 142.24,60.96 | 142.24,60.96 X3.C18 | 264.16,60.96 262.89,60.96 261.62,59.69 205.74,59.69 204.47,60.96 203.2,60.96 | 203.2,60.96 X4.C18 | 325.12,60.96 323.85,60.96 322.58,59.69 266.7,59.69 265.43,60.96 264.16,60.96 | 325.12,60.96 X6.C18 | 264.16,60.96 X5.C18
C19
  Top 0.254: 325.12,58.42 326.39,58.42 327.66,57.15 353.06,57.15 354.33,58.42 355.6,58.42 | 355.6,58.42 356.87,58.42 358.14,57.15 384.81,57.15 386.08,58.42 X8.C19 | 355.6,58.42 X7.C19 | 81.28,58.42 80.01,58.42 78.74,57.15 22.86,57.15 21.59,58.42 20.32,58.42 X1.C19 | 142.24,58.42 140.97,58.42 139.7,57.15 83.82,57.15 82.55,58.42 81.28,58.42 | 81.28,58.42 X2.C19 | 203.2,58.42 201.93,58.42 200.66,57.15 144.78,57.15 143.51,58.42 142.24,58.42 | 142.24,58.42 X3.C19 | 264.16,58.42 262.89,58.42 261.62,57.15 205.74,57.15 204.47,58.42 203.2,58.42 | 203.2,58.42 X4.C19 | 325.12,58.42 323.85,58.42 322.58,57.15 266.7,57.15 265.43,58.42 264.16,58.42 | 325.12,58.42 X6.C19 | 264.16,58.42 X5.C19
C20
  Top 0.254: 325.12,55.88 326.39,55.88 327.66,54.61 353.06,54.61 354.33,55.88 355.6,55.88 | 355.6,55.88 356.87,55.88 358.14,54.61 384.81,54.61 386.08,55.88 X8.C20 | 355.6,55.88 X7.C20 | 81.28,55.88 80.01,55.88 78.74,54.61 22.86,54.61 21.59,55.88 20.32,55.88 X1.C20 | 142.24,55.88 140.97,55.88 139.7,54.61 83.82,54.61 82.55,55.88 81.28,55.88 | 81.28,55.88 X2.C20 | 203.2,55.88 201.93,55.88 200.66,54.61 144.78,54.61 143.51,55.88 142.24,55.88 | 142.24,55.88 X3.C20 | 264.16,55.88 262.89,55.88 261.62,54.61 205.74,54.61 204.47,55.88 203.2,55.88 | 203.2,55.88 X4.C20 | 325.12,55.88 323.85,55.88 322.58,54.61 266.7,54.61 265.43,55.88 264.16,55.88 | 325.12,55.88 X6.C20 | 264.16,55.88 X5.C20
C21
  Top 0.254: 325.12,53.34 326.39,53.34 327.66,52.07 353.06,52.07 354.33,53.34 355.6,53.34 | 355.6,53.34 356.87,53.34 358.14,52.07 384.81,52.07 386.08,53.34 X8.C21 | 355.6,53.34 X7.C21 | 81.28,53.34 80.01,53.34 78.74,52.07 22.86,52.07 21.59,53.34 20.32,53.34 X1.C21 | 142.24,53.34 140.97,53.34 139.7,52.07 83.82,52.07 82.55,53.34 81.28,53.34 | 81.28,53.34 X2.C21 | 203.2,53.34 201.93,53.34 200.66,52.07 144.78,52.07 143.51,53.34 142.24,53.34 | 142.24,53.34 X3.C21 | 264.16,53.34 262.89,53.34 261.62,52.07 205.74,52.07 204.47,53.34 203.2,53.34 | 203.2,53.34 X4.C21 | 325.12,53.34 323.85,53.34 322.58,52.07 266.7,52.07 265.43,53.34 264.16,53.34 | 325.12,53.34 X6.C21 | 264.16,53.34 X5.C21
C22
  Top 0.254: 325.12,50.8 326.39,50.8 327.66,49.53 353.06,49.53 354.33,50.8 355.6,50.8 | 355.6,50.8 356.87,50.8 358.14,49.53 384.81,49.53 386.08,50.8 X8.C22 | 355.6,50.8 X7.C22 | 81.28,50.8 80.01,50.8 78.74,49.53 22.86,49.53 21.59,50.8 20.32,50.8 X1.C22 | 142.24,50.8 140.97,50.8 139.7,49.53 83.82,49.53 82.55,50.8 81.28,50.8 | 81.28,50.8 X2.C22 | 203.2,50.8 201.93,50.8 200.66,49.53 144.78,49.53 143.51,50.8 142.24,50.8 | 142.24,50.8 X3.C22 | 264.16,50.8 262.89,50.8 261.62,49.53 205.74,49.53 204.47,50.8 203.2,50.8 | 203.2,50.8 X4.C22 | 325.12,50.8 323.85,50.8 322.58,49.53 266.7,49.53 265.43,50.8 264.16,50.8 | 325.12,50.8 X6.C22 | 264.16,50.8 X5.C22
C23
  Top 0.254: 325.12,48.26 326.39,48.26 327.66,46.99 353.06,46.99 354.33,48.26 355.6,48.26 | 355.6,48.26 356.87,48.26 358.14,46.99 384.81,46.99 386.08,48.26 X8.C23 | 355.6,48.26 X7.C23 | 81.28,48.26 80.01,48.26 78.74,46.99 22.86,46.99 21.59,48.26 20.32,48.26 X1.C23 | 142.24,48.26 140.97,48.26 139.7,46.99 83.82,46.99 82.55,48.26 81.28,48.26 | 81.28,48.26 X2.C23 | 203.2,48.26 201.93,48.26 200.66,46.99 144.78,46.99 143.51,48.26 142.24,48.26 | 142.24,48.26 X3.C23 | 264.16,48.26 262.89,48.26 261.62,46.99 205.74,46.99 204.47,48.26 203.2,48.26 | 203.2,48.26 X4.C23 | 325.12,48.26 323.85,48.26 322.58,46.99 266.7,46.99 265.43,48.26 264.16,48.26 | 325.12,48.26 X6.C23 | 264.16,48.26 X5.C23
C24
  Top 0.254: 325.12,45.72 326.39,45.72 327.66,44.45 353.06,44.45 354.33,45.72 355.6,45.72 | 355.6,45.72 356.87,45.72 358.14,44.45 384.81,44.45 386.08,45.72 X8.C24 | 355.6,45.72 X7.C24 | 81.28,45.72 80.01,45.72 78.74,44.45 22.86,44.45 21.59,45.72 20.32,45.72 X1.C24 | 142.24,45.72 140.97,45.72 139.7,44.45 83.82,44.45 82.55,45.72 81.28,45.72 | 81.28,45.72 X2.C24 | 203.2,45.72 201.93,45.72 200.66,44.45 144.78,44.45 143.51,45.72 142.24,45.72 | 142.24,45.72 X3.C24 | 264.16,45.72 262.89,45.72 261.62,44.45 205.74,44.45 204.47,45.72 203.2,45.72 | 203.2,45.72 X4.C24 | 325.12,45.72 323.85,45.72 322.58,44.45 266.7,44.45 265.43,45.72 264.16,45.72 | 325.12,45.72 X6.C24 | 264.16,45.72 X5.C24
C25
  Top 0.254: 325.12,43.18 326.39,43.18 327.66,41.91 353.06,41.91 354.33,43.18 355.6,43.18 | 355.6,43.18 356.87,43.18 358.14,41.91 384.81,41.91 386.08,43.18 X8.C25 | 355.6,43.18 X7.C25 | 81.28,43.18 80.01,43.18 78.74,41.91 22.86,41.91 21.59,43.18 20.32,43.18 X1.C25 | 142.24,43.18 140.97,43.18 139.7,41.91 83.82,41.91 82.55,43.18 81.28,43.18 | 81.28,43.18 X2.C25 | 203.2,43.18 201.93,43.18 200.66,41.91 144.78,41.91 143.51,43.18 142.24,43.18 | 142.24,43.18 X3.C25 | 264.16,43.18 262.89,43.18 261.62,41.91 205.74,41.91 204.47,43.18 203.2,43.18 | 203.2,43.18 X4.C25 | 325.12,43.18 323.85,43.18 322.58,41.91 266.7,41.91 265.43,43.18 264.16,43.18 | 325.12,43.18 X6.C25 | 264.16,43.18 X5.C25
C26
  Top 0.254: 325.12,40.64 326.39,40.64 327.66,39.37 353.06,39.37 354.33,40.64 355.6,40.64 | 355.6,40.64 356.87,40.64 358.14,39.37 384.81,39.37 386.08,40.64 X8.C26 | 355.6,40.64 X7.C26 | 81.28,40.64 80.01,40.64 78.74,39.37 22.86,39.37 21.59,40.64 20.32,40.64 X1.C26 | 142.24,40.64 140.97,40.64 139.7,39.37 83.82,39.37 82.55,40.64 81.28,40.64 | 81.28,40.64 X2.C26 | 203.2,40.64 201.93,40.64 200.66,39.37 144.78,39.37 143.51,40.64 142.24,40.64 | 142.24,40.64 X3.C26 | 264.16,40.64 262.89,40.64 261.62,39.37 205.74,39.37 204.47,40.64 203.2,40.64 | 203.2,40.64 X4.C26 | 325.12,40.64 323.85,40.64 322.58,39.37 266.7,39.37 265.43,40.64 264.16,40.64 | 325.12,40.64 X6.C26 | 264.16,40.64 X5.C26
C27
  Top 0.254: 325.12,38.1 326.39,38.1 327.66,36.83 353.06,36.83 354.33,38.1 355.6,38.1 | 355.6,38.1 356.87,38.1 358.14,36.83 384.81,36.83 386.08,38.1 X8.C27 | 355.6,38.1 X7.C27 | 81.28,38.1 80.01,38.1 78.74,36.83 22.86,36.83 21.59,38.1 20.32,38.1 X1.C27 | 142.24,38.1 140.97,38.1 139.7,36.83 83.82,36.83 82.55,38.1 81.28,38.1 | 81.28,38.1 X2.C27 | 203.2,38.1 201.93,38.1 200.66,36.83 144.78,36.83 143.51,38.1 142.24,38.1 | 142.24,38.1 X3.C27 | 264.16,38.1 262.89,38.1 261.62,36.83 205.74,36.83 204.47,38.1 203.2,38.1 | 203.2,38.1 X4.C27 | 325.12,38.1 323.85,38.1 322.58,36.83 266.7,36.83 265.43,38.1 264.16,38.1 | 325.12,38.1 X6.C27 | 264.16,38.1 X5.C27
C28
  Top 0.254: 325.12,35.56 326.39,35.56 327.66,34.29 353.06,34.29 354.33,35.56 355.6,35.56 | 355.6,35.56 356.87,35.56 358.14,34.29 384.81,34.29 386.08,35.56 X8.C28 | 355.6,35.56 X7.C28 | 81.28,35.56 80.01,35.56 78.74,34.29 22.86,34.29 21.59,35.56 20.32,35.56 X1.C28 | 142.24,35.56 140.97,35.56 139.7,34.29 83.82,34.29 82.55,35.56 81.28,35.56 | 81.28,35.56 X2.C28 | 203.2,35.56 201.93,35.56 200.66,34.29 144.78,34.29 143.51,35.56 142.24,35.56 | 142.24,35.56 X3.C28 | 264.16,35.56 262.89,35.56 261.62,34.29 205.74,34.29 204.47,35.56 203.2,35.56 | 203.2,35.56 X4.C28 | 325.12,35.56 323.85,35.56 322.58,34.29 266.7,34.29 265.43,35.56 264.16,35.56 | 325.12,35.56 X6.C28 | 264.16,35.56 X5.C28
C29
  Top 0.254: 325.12,33.02 326.39,33.02 327.66,31.75 353.06,31.75 354.33,33.02 355.6,33.02 | 355.6,33.02 356.87,33.02 358.14,31.75 384.81,31.75 386.08,33.02 X8.C29 | 355.6,33.02 X7.C29 | 81.28,33.02 80.01,33.02 78.74,31.75 22.86,31.75 21.59,33.02 20.32,33.02 X1.C29 | 142.24,33.02 140.97,33.02 139.7,31.75 83.82,31.75 82.55,33.02 81.28,33.02 | 81.28,33.02 X2.C29 | 203.2,33.02 201.93,33.02 200.66,31.75 144.78,31.75 143.51,33.02 142.24,33.02 | 142.24,33.02 X3.C29 | 264.16,33.02 262.89,33.02 261.62,31.75 205.74,31.75 204.47,33.02 203.2,33.02 | 203.2,33.02 X4.C29 | 325.12,33.02 323.85,33.02 322.58,31.75 266.7,31.75 265.43,33.02 264.16,33.02 | 325.12,33.02 X6.C29 | 264.16,33.02 X5.C29
C30
  Top 0.254: 325.12,30.48 326.39,30.48 327.66,29.21 353.06,29.21 354.33,30.48 355.6,30.48 | 355.6,30.48 356.87,30.48 358.14,29.21 384.81,29.21 386.08,30.48 X8.C30 | 355.6,30.48 X7.C30 | 81.28,30.48 80.01,30.48 78.74,29.21 22.86,29.21 21.59,30.48 20.32,30.48 X1.C30 | 142.24,30.48 140.97,30.48 139.7,29.21 83.82,29.21 82.55,30.48 81.28,30.48 | 81.28,30.48 X2.C30 | 203.2,30.48 201.93,30.48 200.66,29.21 144.78,29.21 143.51,30.48 142.24,30.48 | 142.24,30.48 X3.C30 | 264.16,30.48 262.89,30.48 261.62,29.21 205.74,29.21 204.47,30.48 203.2,30.48 | 203.2,30.48 X4.C30 | 325.12,30.48 323.85,30.48 322.58,29.21 266.7,29.21 265.43,30.48 264.16,30.48 | 325.12,30.48 X6.C30 | 264.16,30.48 X5.C30
C31
  Top 0.254: 325.12,27.94 326.39,27.94 327.66,26.67 353.06,26.67 354.33,27.94 355.6,27.94 | 355.6,27.94 356.87,27.94 358.14,26.67 384.81,26.67 386.08,27.94 X8.C31 | 355.6,27.94 X7.C31 | 81.28,27.94 80.01,27.94 78.74,26.67 22.86,26.67 21.59,27.94 20.32,27.94 X1.C31 | 142.24,27.94 140.97,27.94 139.7,26.67 83.82,26.67 82.55,27.94 81.28,27.94 | 81.28,27.94 X2.C31 | 203.2,27.94 201.93,27.94 200.66,26.67 144.78,26.67 143.51,27.94 142.24,27.94 | 142.24,27.94 X3.C31 | 264.16,27.94 262.89,27.94 261.62,26.67 205.74,26.67 204.47,27.94 203.2,27.94 | 203.2,27.94 X4.C31 | 325.12,27.94 323.85,27.94 322.58,26.67 266.7,26.67 265.43,27.94 264.16,27.94 | 325.12,27.94 X6.C31 | 264.16,27.94 X5.C31
C32
  Top 0.254: 325.12,25.4 326.39,24.13 354.33,24.13 | 354.33,24.13 355.6,25.4 X7.C32 | 354.33,24.13 384.81,24.13 386.08,25.4 X8.C32 | 80.01,24.13 21.59,24.13 20.32,25.4 X1.C32 | 80.01,24.13 81.28,25.4 X2.C32 | 140.97,24.13 142.24,25.4 X3.C32 | 80.01,24.13 140.97,24.13 | 201.93,24.13 203.2,25.4 X4.C32 | 140.97,24.13 201.93,24.13 | 262.89,24.13 264.16,25.4 X5.C32 | 201.93,24.13 262.89,24.13 | 325.12,25.4 323.85,24.13 262.89,24.13 | 325.12,25.4 X6.C32